# EAGLE design Floppy Shield (EAGLE 6.5.0)
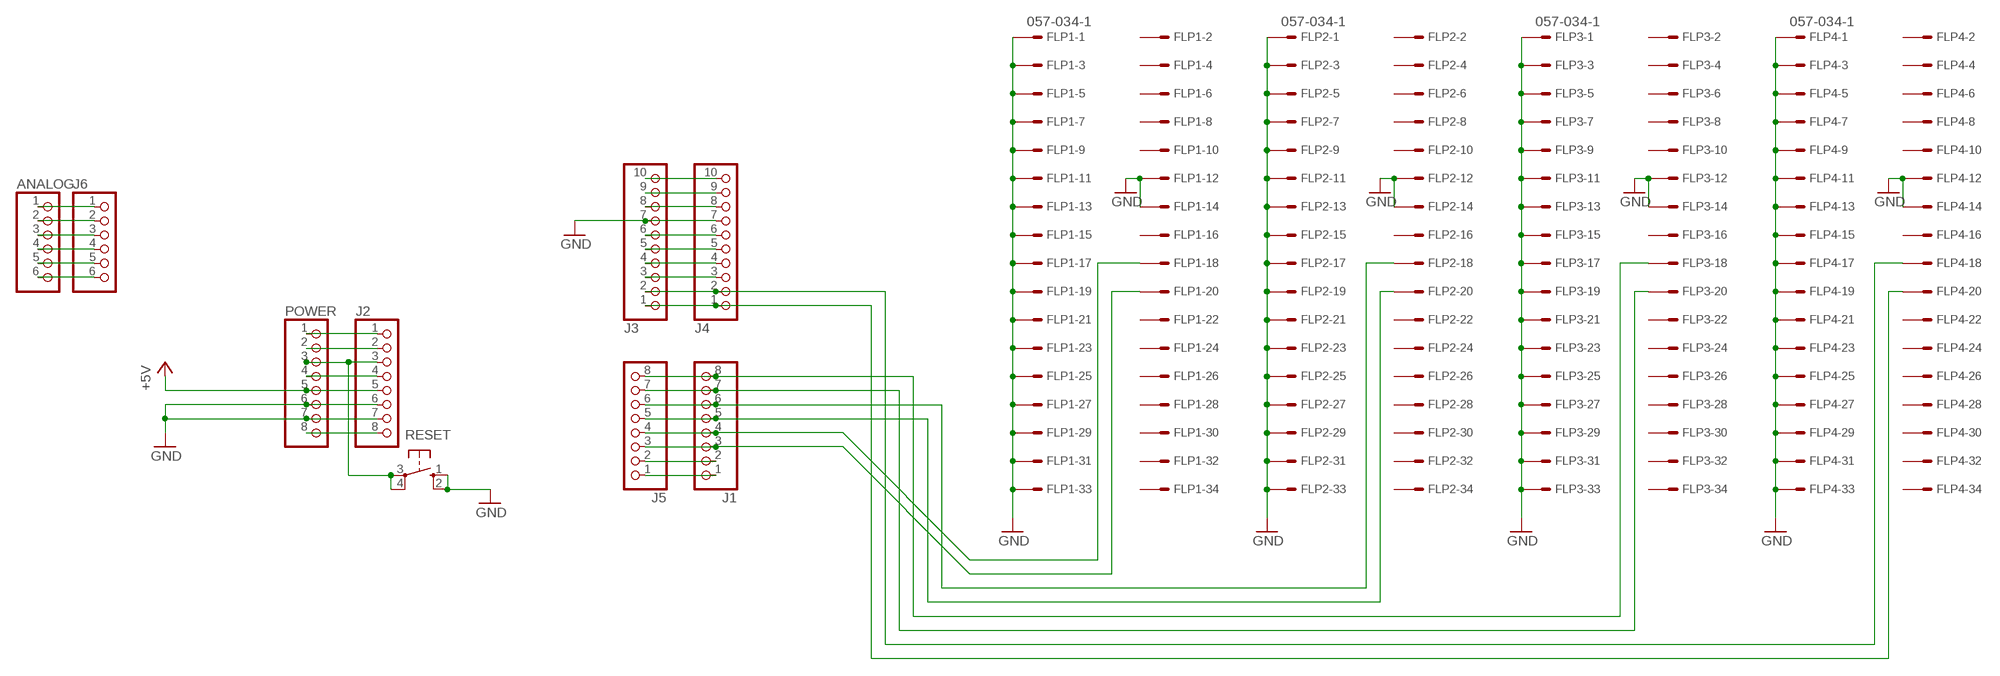
[diagram p0: schematic, sheet 1]

## Parts
ANALOG  PINHD-1X6  [1X06]
FLP1  057-034-1  [057-034-1]
FLP2  057-034-1  [057-034-1]
FLP3  057-034-1  [057-034-1]
FLP4  057-034-1  [057-034-1]
J1  PINHD-1X8TH  [1X08-TH]
J2  PINHD-1X8TH  [1X08-TH]
J3  PINHD-1X10TH  [1X10-TH]
J4  PINHD-1X10TH  [1X10-TH]
J5  PINHD-1X8TH  [1X08-TH]
J6  PINHD-1X6  [1X06]
POWER  PINHD-1X8TH  [1X08-TH]
RESET  10-XX  [B3F-10XX]

## Nets
+5V: J2.5 POWER.5
+9V: J2.8 POWER.8
GND: FLP1.1 FLP1.3 FLP1.5 FLP1.7 FLP1.9 FLP1.11 FLP1.12 FLP1.13 FLP1.14 FLP1.15 FLP1.17 FLP1.19 FLP1.21 FLP1.23 FLP1.25 FLP1.27 FLP1.29 FLP1.31 FLP1.33 FLP2.1 FLP2.3 FLP2.5 FLP2.7 FLP2.9 FLP2.11 FLP2.12 FLP2.13 FLP2.14 FLP2.15 FLP2.17 FLP2.19 FLP2.21 FLP2.23 FLP2.25 FLP2.27 FLP2.29 FLP2.31 FLP2.33 FLP3.1 FLP3.3 FLP3.5 FLP3.7 FLP3.9 FLP3.11 FLP3.12 FLP3.13 FLP3.14 FLP3.15 FLP3.17 FLP3.19 FLP3.21 FLP3.23 FLP3.25 FLP3.27 FLP3.29 FLP3.31 FLP3.33 FLP4.1 FLP4.3 FLP4.5 FLP4.7 FLP4.9 FLP4.11 FLP4.12 FLP4.13 FLP4.14 FLP4.15 FLP4.17 FLP4.19 FLP4.21 FLP4.23 FLP4.25 FLP4.27 FLP4.29 FLP4.31 FLP4.33 J2.6 J2.7 J3.7 J4.7 POWER.6 POWER.7 RESET.1(S) RESET.2(S1)
N$1: J3.6 J4.6
N$2: FLP4.20 J3.1 J4.1
N$3: J3.4 J4.4
N$4: J3.5 J4.5
N$5: FLP1.18 J1.4 J5.4
N$6: FLP2.18 J1.6 J5.6
N$7: J3.3 J4.3
N$12: FLP1.20 J1.3 J5.3
N$13: FLP2.20 J1.5 J5.5
N$14: FLP3.20 J1.7 J5.7
N$15: FLP3.18 J1.8 J5.8
N$16: J1.1 J5.1
N$18: ANALOG.1 J6.1
N$19: ANALOG.2 J6.2
N$20: ANALOG.3 J6.3
N$21: ANALOG.4 J6.4
N$22: ANALOG.5 J6.5
N$23: ANALOG.6 J6.6
N$24: J1.2 J5.2
N$26: FLP4.18 J3.2 J4.2
N$31: J2.2 POWER.2
N$32: J2.1 POWER.1
N$141: J3.9 J4.9
N$142: J3.10 J4.10
N$222: J3.8 J4.8
N$223: J2.4 POWER.4
RESET: J2.3 POWER.3 RESET.3(P) RESET.4(P1)
Unconnected: FLP1.2 FLP1.4 FLP1.6 FLP1.8 FLP1.10 FLP1.16 FLP1.22 FLP1.24 FLP1.26 FLP1.28 FLP1.30 FLP1.32 FLP1.34 FLP2.2 FLP2.4 FLP2.6 FLP2.8 FLP2.10 FLP2.16 FLP2.22 FLP2.24 FLP2.26 FLP2.28 FLP2.30 FLP2.32 FLP2.34 FLP3.2 FLP3.4 FLP3.6 FLP3.8 FLP3.10 FLP3.16 FLP3.22 FLP3.24 FLP3.26 FLP3.28 FLP3.30 FLP3.32 FLP3.34 FLP4.2 FLP4.4 FLP4.6 FLP4.8 FLP4.10 FLP4.16 FLP4.22 FLP4.24 FLP4.26 FLP4.28 FLP4.30 FLP4.32 FLP4.34

## Library data of the parts
ANALOG J6 = pinhead:PINHD-1X6: PIN HEADER
FLP1-FLP4 = con-panduit:057-034-: CONNECTOR 34-pin series 057 contact pc board low profile headers; OC_FARNELL: unknown; OC_NEWARK: unknown
J1 J2 J5 POWER = SmartPrj:PINHD-1X8: PIN HEADER
J3 J4 = SmartPrj:PINHD-1X10: PIN HEADER
RESET = switch-omron:10-XX: OMRON SWITCH

## Board
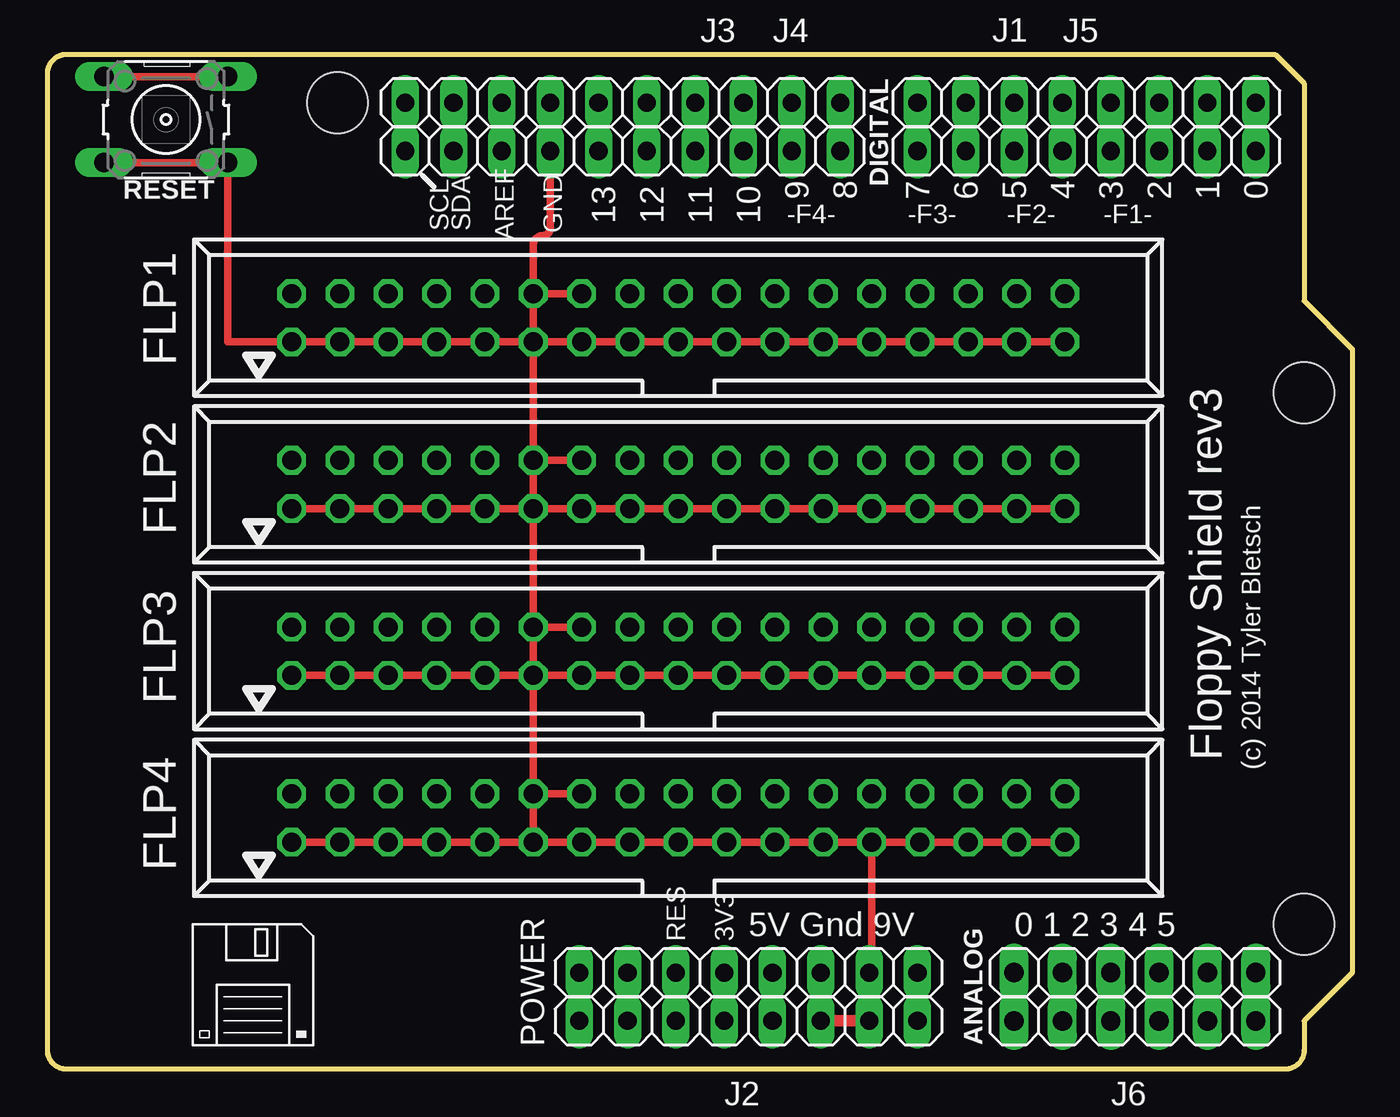
[diagram p1: board, top side]
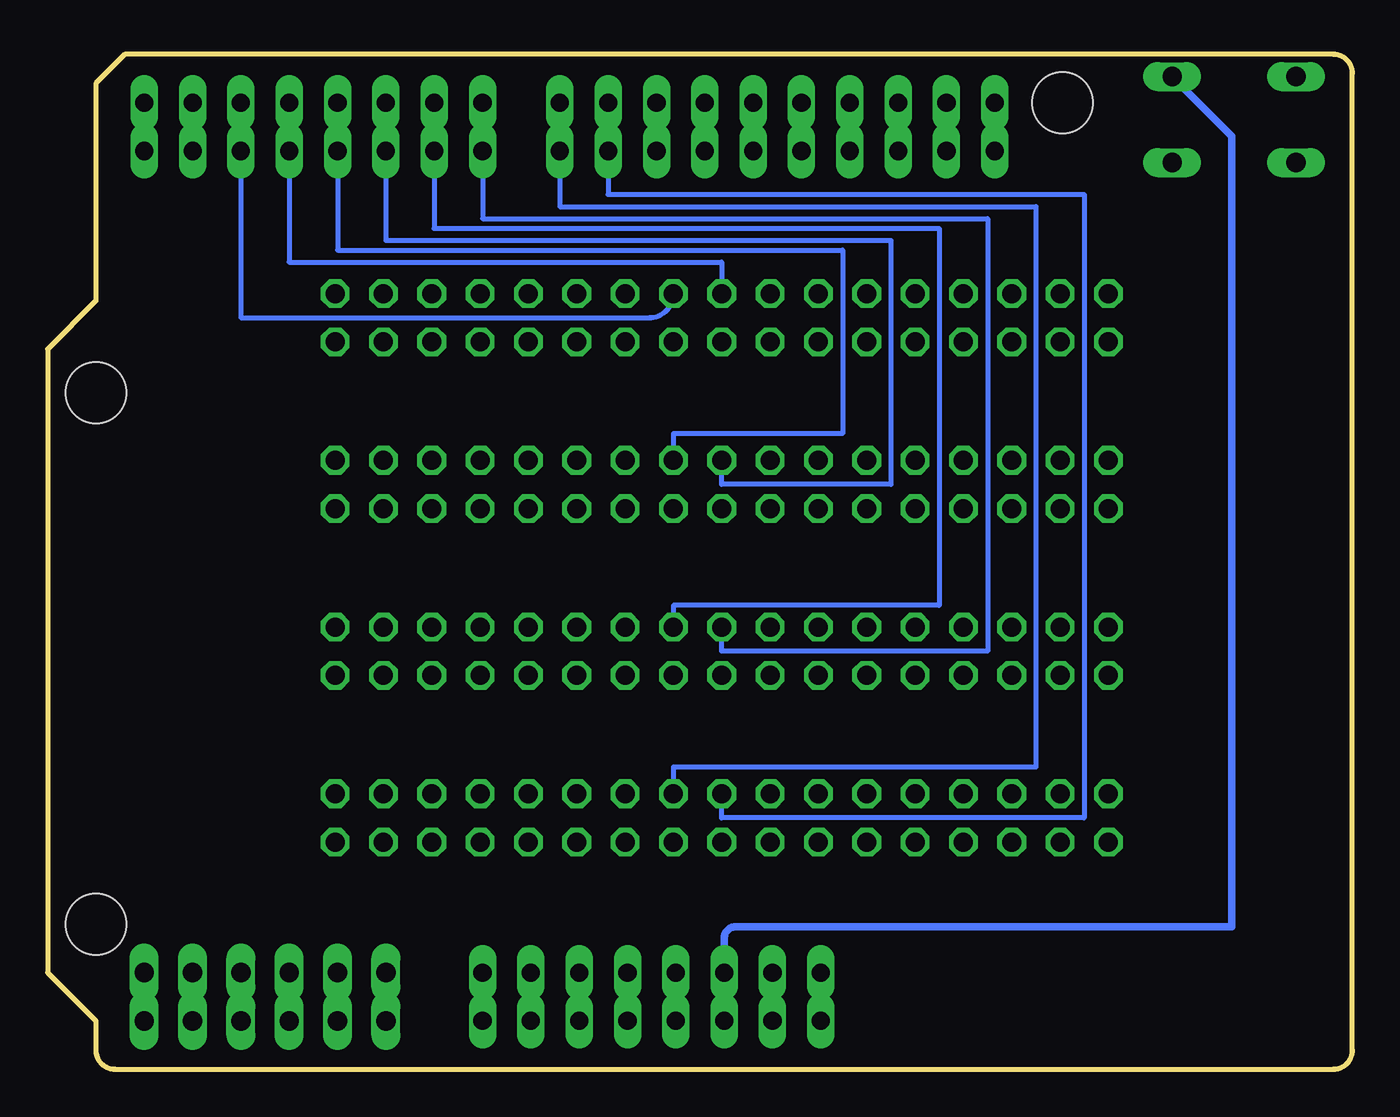
[diagram p2: board, bottom side, seen from below]

Size 68.58 x 53.34 mm. Coordinates in mm from the lower left corner, seen from the top.
Outline: 64.52,53.34 66.04,51.82 66.04,40.39 68.58,37.85 68.58,5.08 66.04,2.54 66.04,1 arc-90 65.04,0 1,0 arc-90 0,1 0,52.34 arc-90 1,53.34 64.52,53.34
Copper layers (1*16): Top 0.035mm / dielectric 1.5mm / Bottom 0.035mm
Design rules "Elecrow_2-layer_eagle_rule": minimum track width 6mil, minimum drill 12mil, track to track 6mil, track to pad 6mil, pad to pad 6mil, via to via 6mil, smd to smd 0mil, copper to edge 10mil, drill to drill 10mil, minimum pad ring 10mil, minimum via ring 6mil, stop-mask expansion 2mil, vias tented up to drill 100mil, thermal gap 10mil
Holes 3.2 mm at 15.24,50.8 66.04,7.62 66.04,35.56

### Footprints (pad centres in the part's own frame; a part is rotated, then mirrored left to right if it is on the bottom)
1X06 = drill 1.016 long: 1 -6.35,0; 2 -3.81,0; 3 -1.27,0; 4 1.27,0; 5 3.81,0; 6 6.35,0
057-034-1 = drill 1 octagon: 1 -20.32,-1.27; 2 -20.32,1.27; 3 -17.78,-1.27; 4 -17.78,1.27; 5 -15.24,-1.27; 6 -15.24,1.27; 7 -12.7,-1.27; 8 -12.7,1.27; 9 -10.16,-1.27; 10 -10.16,1.27; 11 -7.62,-1.27; 12 -7.62,1.27; 13 -5.08,-1.27; 14 -5.08,1.27; 15 -2.54,-1.27; 16 -2.54,1.27; 17 0,-1.27; 18 0,1.27; 19 2.54,-1.27; 20 2.54,1.27; 21 5.08,-1.27; 22 5.08,1.27; 23 7.62,-1.27; 24 7.62,1.27; 25 10.16,-1.27; 26 10.16,1.27; 27 12.7,-1.27; 28 12.7,1.27; 29 15.24,-1.27; 30 15.24,1.27; 31 17.78,-1.27; 32 17.78,1.27; 33 20.32,-1.27; 34 20.32,1.27
1X08-TH = drill 0.95 pad 1.422 long: 1 -8.89,0; 2 -6.35,0; 3 -3.81,0; 4 -1.27,0; 5 1.27,0; 6 3.81,0; 7 6.35,0; 8 8.89,0
1X10-TH = drill 0.95 pad 1.422 long: 1 -11.43,0; 2 -8.89,0; 3 -6.35,0; 4 -3.81,0; 5 -1.27,0; 6 1.27,0; 7 3.81,0; 8 6.35,0; 9 8.89,0; 10 11.43,0
B3F-10XX = drill 1.016 long: 1 -3.251,2.261; 2 3.251,2.261; 3 -3.251,-2.261; 4 3.251,-2.261

### Placement (x,y rotation side)
ANALOG  57.15,2.54 0 top
FLP1  33.15,39.5 0 top
FLP2  33.15,30.73 0 top
FLP3  33.15,21.97 0 top
FLP4  33.15,13.21 0 top
J1  54.61,50.8 180 top
J2  36.83,2.54 0 top
J3  30.23,50.8 180 top
J4  30.23,48.26 180 top
J5  54.61,48.26 180 top
J6  57.15,5.08 0 top
POWER  36.83,5.08 0 top
RESET  6.22,49.91 180 top

### Tracks (layer width: path | path; a pad name or v marks a point on that pad's centre or on a via)
+5V
  Top 0.61: J2.5 POWER.5
+9V
  Top 0.61: J2.8 POWER.8
GND
  Top 0.406: POWER.7 43.31,5.08 FLP4.25 | FLP4.25 FLP4.23 FLP4.21 FLP4.19 FLP4.17 FLP4.15 FLP4.13 FLP4.11 | FLP4.11 FLP4.9 FLP4.7 FLP4.5 FLP4.3 FLP4.1 | FLP4.25 FLP4.27 FLP4.29 FLP4.31 FLP4.33 | FLP4.11 FLP4.12 | FLP4.12 FLP3.11 | FLP3.11 FLP3.9 FLP3.7 FLP3.5 FLP3.3 FLP3.1 | FLP3.11 FLP3.13 FLP3.15 FLP3.17 FLP3.19 FLP3.21 FLP3.23 FLP3.25 FLP3.27 FLP3.29 FLP3.31 FLP3.33 | FLP1.12 FLP1.11 | FLP1.11 FLP2.12 | FLP2.12 FLP2.11 | FLP2.11 FLP3.12 | FLP3.12 FLP3.11 | FLP1.11 FLP1.9 FLP1.7 FLP1.5 FLP1.3 FLP1.1 9.47,38.23 RESET.1 RESET.2 | FLP1.11 FLP1.13 FLP1.15 FLP1.17 FLP1.19 FLP1.21 FLP1.23 FLP1.25 FLP1.27 FLP1.29 FLP1.31 FLP1.33 | FLP2.1 FLP2.3 FLP2.5 FLP2.7 FLP2.9 FLP2.11 | FLP2.11 FLP2.13 FLP2.15 FLP2.17 FLP2.19 FLP2.21 FLP2.23 FLP2.25 FLP2.27 FLP2.29 FLP2.31 FLP2.33 | FLP1.14 FLP1.12 | FLP2.14 FLP2.12 | FLP3.14 FLP3.12 | FLP4.14 FLP4.12 | J4.7 26.42,44.2 arc-90 26.04,43.81 arc90 25.53,43.31 FLP1.12
  Top 0.61: POWER.7 J2.7 J2.6 POWER.6 | J4.7 J3.7
N$1
  Top 0.61: J3.6 J4.6
N$2
  Top 0.61: J3.1 J4.1
  Bottom 0.254: J4.1 41.66,45.34 16.64,45.34 16.64,15.88 35.69,15.88 FLP4.20
N$3
  Top 0.61: J3.4 J4.4
N$4
  Top 0.61: J4.5 J3.5
N$5
  Top 0.61: J1.4 J5.4
  Bottom 0.254: J5.4 55.88,42.42 33.15,42.42 FLP1.18
N$6
  Top 0.61: J1.6 J5.6
  Bottom 0.254: J5.6 50.8,43.56 24.26,43.56 24.26,30.73 33.15,30.73 FLP2.18
N$7
  Top 0.61: J4.3 J3.3
N$12
  Top 0.61: J5.3 J1.3
  Bottom 0.254: J5.3 58.42,39.5 36.96,39.5 arc-90 FLP1.20
N$13
  Top 0.61: J5.5 J1.5
  Bottom 0.254: J5.5 53.34,43.05 26.8,43.05 26.8,33.4 35.69,33.4 FLP2.20
N$14
  Top 0.61: J5.7 J1.7
  Bottom 0.254: J5.7 48.26,44.2 21.72,44.2 21.72,24.38 35.69,24.38 FLP3.20
N$15
  Top 0.61: J1.8 J5.8
  Bottom 0.254: J5.8 45.72,44.7 19.18,44.7 19.18,21.97 33.15,21.97 FLP3.18
N$16
  Top 0.61: J5.1 J1.1
N$18
  Top 0.61: ANALOG.1 J6.1
N$19
  Top 0.61: ANALOG.2 J6.2
N$20
  Top 0.61: ANALOG.3 J6.3
N$21
  Top 0.61: ANALOG.4 J6.4
N$22
  Top 0.61: ANALOG.5 J6.5
N$23
  Top 0.61: ANALOG.6 J6.6
N$24
  Top 0.61: J1.2 J5.2
N$26
  Top 0.61: J3.2 J4.2
  Bottom 0.254: J4.2 39.12,45.97 14.1,45.97 14.1,13.21 33.15,13.21 FLP4.18
N$31
  Top 0.61: J2.2 POWER.2
N$32
  Top 0.61: J2.1 POWER.1
N$141
  Top 0.61: J4.9 J3.9
N$142
  Top 0.61: J3.10 J4.10
N$222
  Top 0.61: J3.8 J4.8
N$223
  Top 0.61: J2.4 POWER.4
RESET
  Top 0.406: RESET.3 RESET.4
  Top 0.61: J2.3 POWER.3
  Bottom 0.406: RESET.3 6.35,49.05 6.35,7.49 32.38,7.49 arc-90 33.02,6.86 POWER.3

### Text on the board
tPlace: 9 | 8 | 7 | 6 | 5 | 4 | 3 | 2 | 1 | 0 | 13 | 12 | 11 | 10 | -F4- | -F3- | -F2- | -F1- | Floppy Shield rev3 | (c) 2014 Tyler Bletsch
tNames: DIGITAL | AREF | SCL | SDA | GND | RES | 3V3 | 5V Gnd 9V | 0 1 2 3 4 5